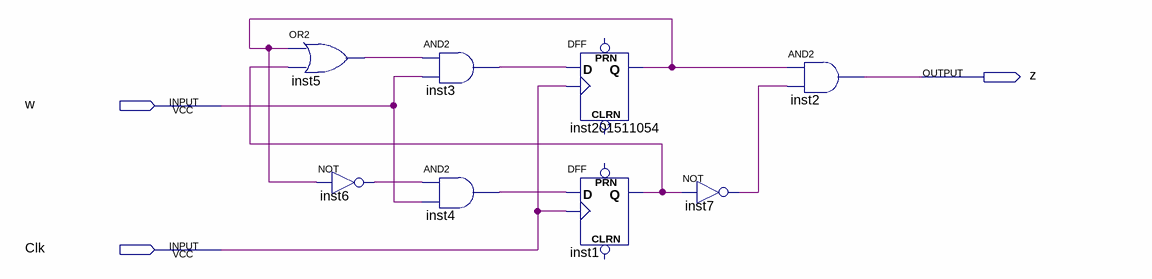
[diagram p0: schematic sheet]
// Quartus schematic lab06_1.bdf as structural Verilog: 8 symbols, 3 pins
module lab06_1 (
  input  w,
  input  Clk,
  output z
);

  wire inst1_q, inst3_out, inst4_out, inst5_out, inst6_out, inst7_out, inst201511054_q;

  or inst5 (inst5_out, inst201511054_q, inst1_q);
  not inst6 (inst6_out, inst201511054_q);
  and inst3 (inst3_out, inst5_out, w);
  and inst4 (inst4_out, inst6_out, w);
  DFF inst201511054 (.CLK(Clk), .D(inst3_out), .Q(inst201511054_q));  // open: CLRN, PRN
  DFF inst1 (.CLK(Clk), .D(inst4_out), .Q(inst1_q));  // open: CLRN, PRN
  not inst7 (inst7_out, inst1_q);
  and inst2 (z, inst201511054_q, inst7_out);
endmodule
